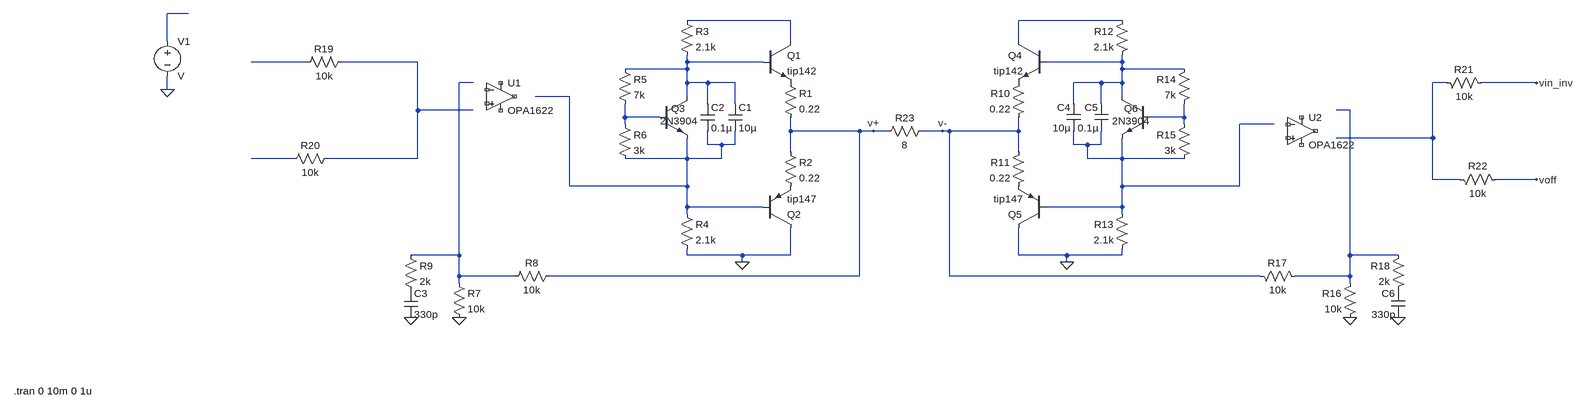
[diagram p0: schematic push_pull_swing.asc]
push_pull_swing.asc, the LTspice schematic file:
Version 4
SHEET 1 2456 9784
WIRE -1120 -448 -1168 -448
WIRE 624 -432 384 -432
WIRE 1392 -432 1152 -432
WIRE -1168 -384 -1168 -448
WIRE 624 -384 624 -432
WIRE 1152 -384 1152 -432
WIRE -544 -336 -672 -336
WIRE -240 -336 -464 -336
WIRE 384 -336 384 -352
WIRE 560 -336 384 -336
WIRE 1392 -336 1392 -352
WIRE 1392 -336 1216 -336
WIRE 384 -320 384 -336
WIRE 384 -320 240 -320
WIRE 1392 -320 1392 -336
WIRE 1536 -320 1392 -320
WIRE -112 -288 -144 -288
WIRE 384 -288 384 -320
WIRE 432 -288 384 -288
WIRE 496 -288 432 -288
WIRE 1344 -288 1280 -288
WIRE 1392 -288 1392 -320
WIRE 1392 -288 1344 -288
WIRE 2144 -288 2112 -288
WIRE 2352 -288 2224 -288
WIRE -1168 -272 -1168 -304
WIRE 112 -256 32 -256
WIRE 384 -256 384 -288
WIRE 1392 -256 1392 -288
WIRE 432 -240 432 -288
WIRE 496 -240 496 -288
WIRE 1280 -240 1280 -288
WIRE 1344 -240 1344 -288
WIRE -240 -224 -240 -336
WIRE -112 -224 -240 -224
WIRE 1920 -224 1888 -224
WIRE 240 -208 240 -240
WIRE 320 -208 240 -208
WIRE 1536 -208 1536 -240
WIRE 1536 -208 1456 -208
WIRE 240 -192 240 -208
WIRE 1536 -192 1536 -208
WIRE 1744 -192 1664 -192
WIRE 624 -176 624 -208
WIRE 784 -176 624 -176
WIRE 816 -176 784 -176
WIRE 848 -176 816 -176
WIRE 976 -176 928 -176
WIRE 992 -176 976 -176
WIRE 1152 -176 1152 -208
WIRE 1152 -176 992 -176
WIRE 2112 -160 2112 -288
WIRE 2112 -160 1888 -160
WIRE 432 -144 432 -176
WIRE 464 -144 432 -144
WIRE 496 -144 496 -176
WIRE 496 -144 464 -144
WIRE 1280 -144 1280 -176
WIRE 1312 -144 1280 -144
WIRE 1344 -144 1344 -176
WIRE 1344 -144 1312 -144
WIRE 624 -128 624 -176
WIRE 1152 -128 1152 -176
WIRE -576 -112 -672 -112
WIRE -240 -112 -240 -224
WIRE -240 -112 -496 -112
WIRE 384 -112 384 -160
WIRE 384 -112 240 -112
WIRE 464 -112 464 -144
WIRE 464 -112 384 -112
WIRE 1312 -112 1312 -144
WIRE 1392 -112 1392 -160
WIRE 1392 -112 1312 -112
WIRE 1536 -112 1392 -112
WIRE 2112 -64 2112 -160
WIRE 2176 -64 2112 -64
WIRE 2352 -64 2256 -64
WIRE 112 -48 112 -256
WIRE 384 -48 384 -112
WIRE 384 -48 112 -48
WIRE 1392 -48 1392 -112
WIRE 1664 -48 1664 -192
WIRE 1664 -48 1392 -48
WIRE 384 0 384 -48
WIRE 560 0 384 0
WIRE 1392 0 1392 -48
WIRE 1392 0 1216 0
WIRE 384 16 384 0
WIRE 1392 16 1392 0
WIRE -144 112 -144 -288
WIRE -144 112 -256 112
WIRE 384 112 384 96
WIRE 512 112 384 112
WIRE 624 112 624 48
WIRE 624 112 512 112
WIRE 1152 112 1152 48
WIRE 1264 112 1152 112
WIRE 1392 112 1392 96
WIRE 1392 112 1264 112
WIRE 1920 112 1920 -224
WIRE 2032 112 1920 112
WIRE 512 128 512 112
WIRE 1264 128 1264 112
WIRE -144 160 -144 112
WIRE -16 160 -144 160
WIRE 784 160 784 -176
WIRE 784 160 64 160
WIRE 992 160 992 -176
WIRE 1712 160 992 160
WIRE 1920 160 1920 112
WIRE 1920 160 1792 160
WIRE -144 176 -144 160
WIRE 1920 176 1920 160
FLAG -144 256 0
FLAG -256 256 0
FLAG 512 128 0
FLAG 1920 256 0
FLAG 2032 256 0
FLAG 1264 128 0
FLAG 2352 -64 voff
FLAG 2352 -288 vin_inv
FLAG 816 -176 v+
FLAG 976 -176 v-
FLAG -1168 -272 0
SYMBOL npn 560 -384 R0
SYMATTR InstName Q1
SYMATTR Value tip142
SYMATTR Prefix X
SYMBOL pnp 560 48 M180
SYMATTR InstName Q2
SYMATTR Value tip147
SYMATTR Prefix X
SYMBOL res 608 -304 R0
SYMATTR InstName R1
SYMATTR Value 0.22
SYMBOL res 608 -144 R0
SYMATTR InstName R2
SYMATTR Value 0.22
SYMBOL res 368 -448 R0
SYMATTR InstName R3
SYMATTR Value 2.1k
SYMBOL res 368 0 R0
SYMATTR InstName R4
SYMATTR Value 2.1k
SYMBOL npn 320 -256 R0
WINDOW 0 27 27 Left 2
WINDOW 3 2 56 Left 2
SYMATTR InstName Q3
SYMATTR Value 2N3904
SYMBOL res 224 -336 R0
SYMATTR InstName R5
SYMATTR Value 7k
SYMBOL res 224 -208 R0
SYMATTR InstName R6
SYMATTR Value 3k
SYMBOL cap 480 -240 R0
SYMATTR InstName C1
SYMATTR Value 10µ
SYMBOL cap 416 -240 R0
SYMATTR InstName C2
SYMATTR Value 0.1µ
SYMBOL res -160 160 R0
SYMATTR InstName R7
SYMATTR Value 10k
SYMBOL res 80 144 R90
WINDOW 0 0 56 VBottom 2
WINDOW 3 32 56 VTop 2
SYMATTR InstName R8
SYMATTR Value 10k
SYMBOL res -272 96 R0
SYMATTR InstName R9
SYMATTR Value 2k
SYMBOL cap -272 192 R0
SYMATTR InstName C3
SYMATTR Value 330p
SYMBOL npn 1216 -384 M0
SYMATTR InstName Q4
SYMATTR Value tip142
SYMATTR Prefix X
SYMBOL pnp 1216 48 R180
SYMATTR InstName Q5
SYMATTR Value tip147
SYMATTR Prefix X
SYMBOL res 1168 -304 M0
SYMATTR InstName R10
SYMATTR Value 0.22
SYMBOL res 1168 -144 M0
SYMATTR InstName R11
SYMATTR Value 0.22
SYMBOL res 1408 -448 M0
SYMATTR InstName R12
SYMATTR Value 2.1k
SYMBOL res 1408 0 M0
SYMATTR InstName R13
SYMATTR Value 2.1k
SYMBOL npn 1456 -256 M0
WINDOW 0 27 27 Left 2
WINDOW 3 2 56 Left 2
SYMATTR InstName Q6
SYMATTR Value 2N3904
SYMBOL res 1552 -336 M0
SYMATTR InstName R14
SYMATTR Value 7k
SYMBOL res 1552 -208 M0
SYMATTR InstName R15
SYMATTR Value 3k
SYMBOL cap 1296 -240 M0
SYMATTR InstName C4
SYMATTR Value 10µ
SYMBOL cap 1360 -240 M0
SYMATTR InstName C5
SYMATTR Value 0.1µ
SYMBOL res 1936 160 M0
SYMATTR InstName R16
SYMATTR Value 10k
SYMBOL res 1696 144 M90
WINDOW 0 0 56 VBottom 2
WINDOW 3 32 56 VTop 2
SYMATTR InstName R17
SYMATTR Value 10k
SYMBOL res 2048 96 M0
SYMATTR InstName R18
SYMATTR Value 2k
SYMBOL cap 2048 192 M0
SYMATTR InstName C6
SYMATTR Value 330p
SYMBOL res -448 -352 R90
WINDOW 0 0 56 VBottom 2
WINDOW 3 32 56 VTop 2
SYMATTR InstName R19
SYMATTR Value 10k
SYMBOL res -480 -128 R90
WINDOW 0 0 56 VBottom 2
WINDOW 3 32 56 VTop 2
SYMATTR InstName R20
SYMATTR Value 10k
SYMBOL res 2128 -304 M90
WINDOW 0 0 56 VBottom 2
WINDOW 3 32 56 VTop 2
SYMATTR InstName R21
SYMATTR Value 10k
SYMBOL res 2160 -80 M90
WINDOW 0 0 56 VBottom 2
WINDOW 3 32 56 VTop 2
SYMATTR InstName R22
SYMATTR Value 10k
SYMBOL res 944 -192 R90
WINDOW 0 0 56 VBottom 2
WINDOW 3 32 56 VTop 2
SYMATTR InstName R23
SYMATTR Value 8
SYMBOL OpAmps\\opamp2 -48 -320 R0
SYMATTR InstName U1
SYMATTR Value OPA1622
SYMBOL OpAmps\\opamp2 1808 -240 R0
SYMATTR InstName U2
SYMATTR Value OPA1622
SYMBOL voltage -1168 -400 R0
SYMATTR InstName V1
TEXT -5848 9768 Left 2 !.tran 0 10m 0 1u

The netlist it stands for:
* push_pull_swing.asc
XQ1 N002 N006 P001 tip142  ; pins C B E
XQ2 0 N010 P002 tip147  ; pins C B E
R1 P001 v+ 0.22
R2 v+ P002 0.22
R3 N002 N006 2.1k
R4 N010 0 2.1k
Q3 N006 N012 N010 0 2N3904
R5 N006 N012 7k
R6 N012 N010 3k
C1 N006 N010 10µ
C2 N006 N010 0.1µ
R7 N008 0 10k
R8 v+ N008 10k
R9 N008 P003 2k
C3 P003 0 330p
XQ4 N003 N007 P004 tip142  ; pins C B E
XQ5 0 N014 P005 tip147  ; pins C B E
R10 P004 v- 0.22
R11 v- P005 0.22
R12 N003 N007 2.1k
R13 N014 0 2.1k
Q6 N007 N013 N014 0 2N3904
R14 N007 N013 7k
R15 N013 N014 3k
C4 N007 N014 10µ
C5 N007 N014 0.1µ
R16 N011 0 10k
R17 v- N011 10k
R18 N011 P006 2k
C6 P006 0 330p
R19 N005 N004 10k
R20 N005 N015 10k
R21 N009 vin_inv 10k
R22 N009 voff 10k
R23 v- v+ 8
XU1 NC_01 NC_02 NC_03 NC_04 NC_05 OPA1622  ; pins In+ In- V+ V- OUT
XU2 NC_06 NC_07 NC_08 NC_09 NC_10 OPA1622  ; pins In+ In- V+ V- OUT
V1 N001 0 V
.model NPN NPN
.model PNP PNP
.lib standard.bjt
.tran 0 10m 0 1u
.backanno
.end